# EAGLE design PSPS_AVNC_SRD_power-2020-10-14 (EAGLE 9.6.2)
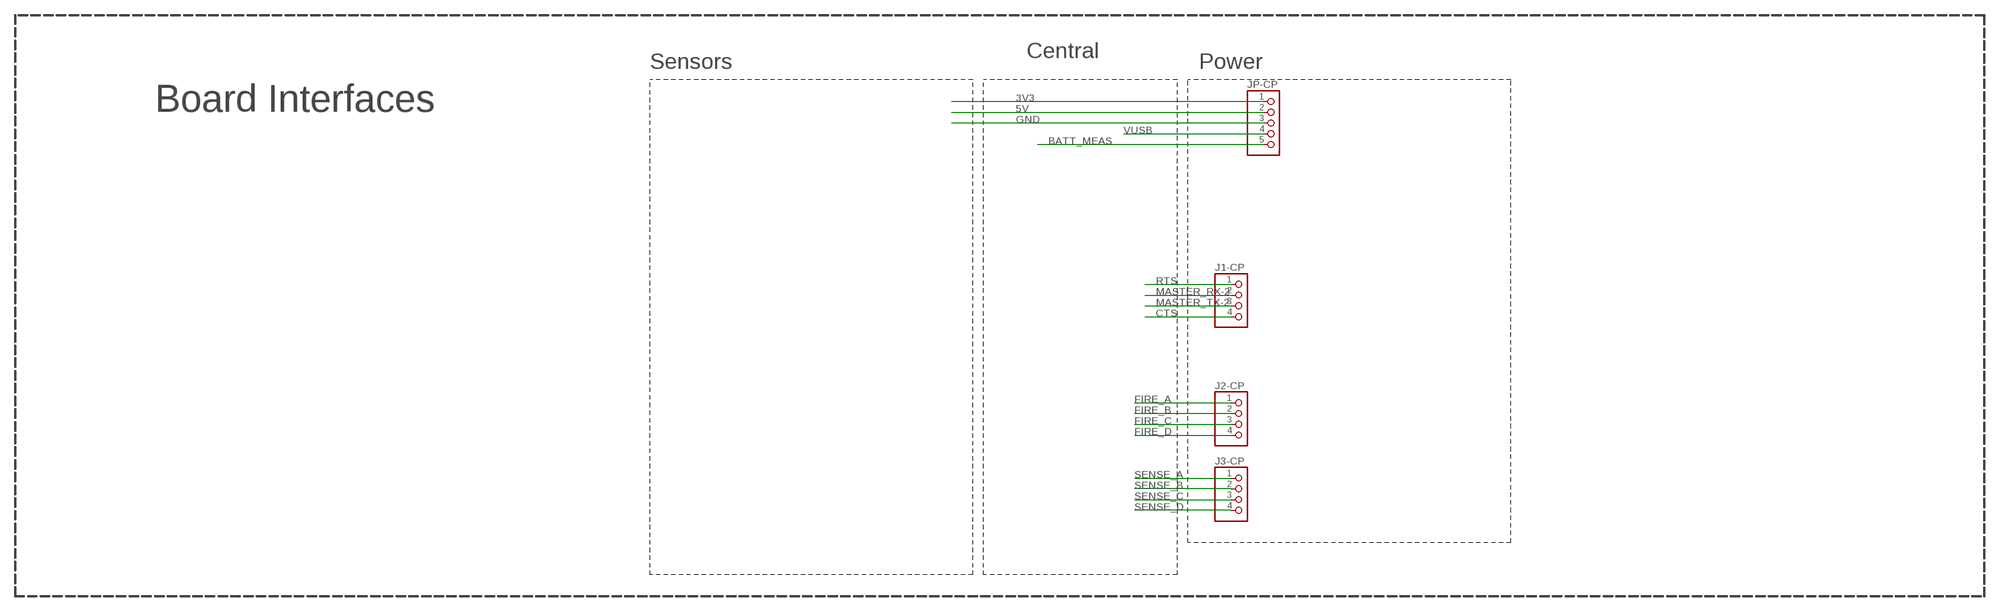
[diagram p0: schematic, sheet 1, part 1 of 3]
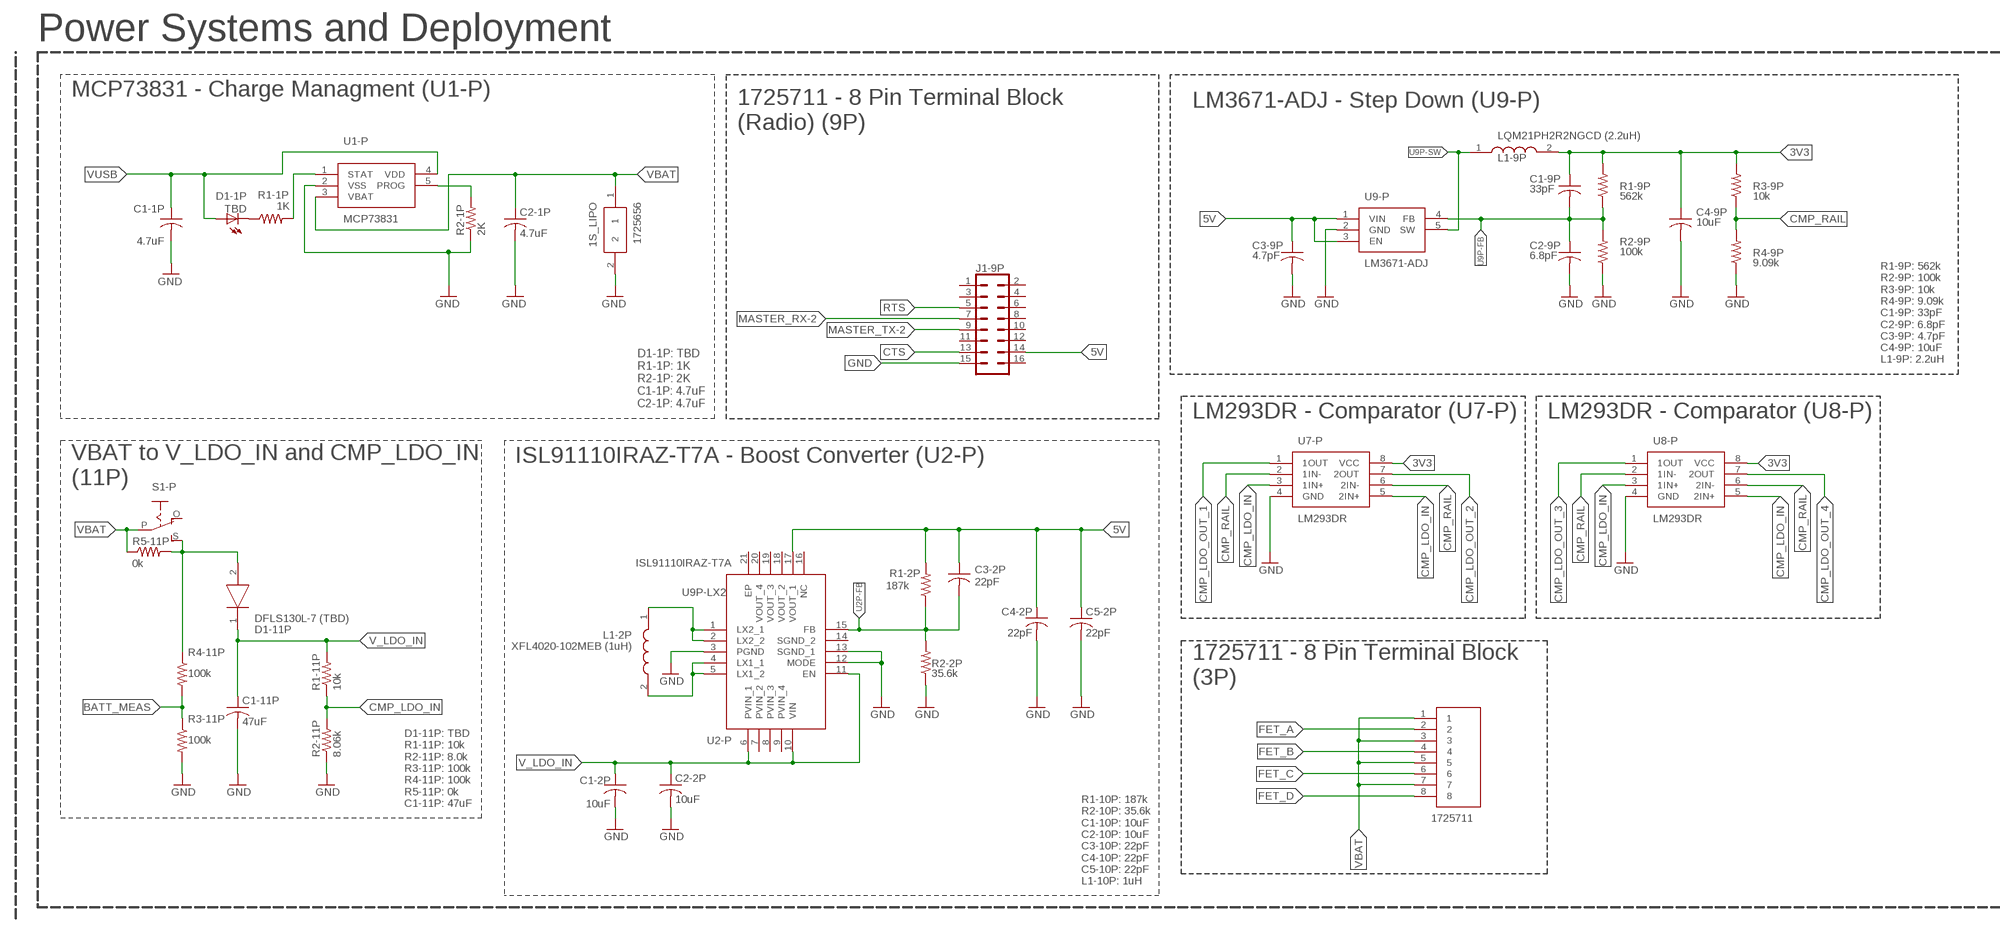
[diagram p1: schematic, sheet 1, part 2 of 3]
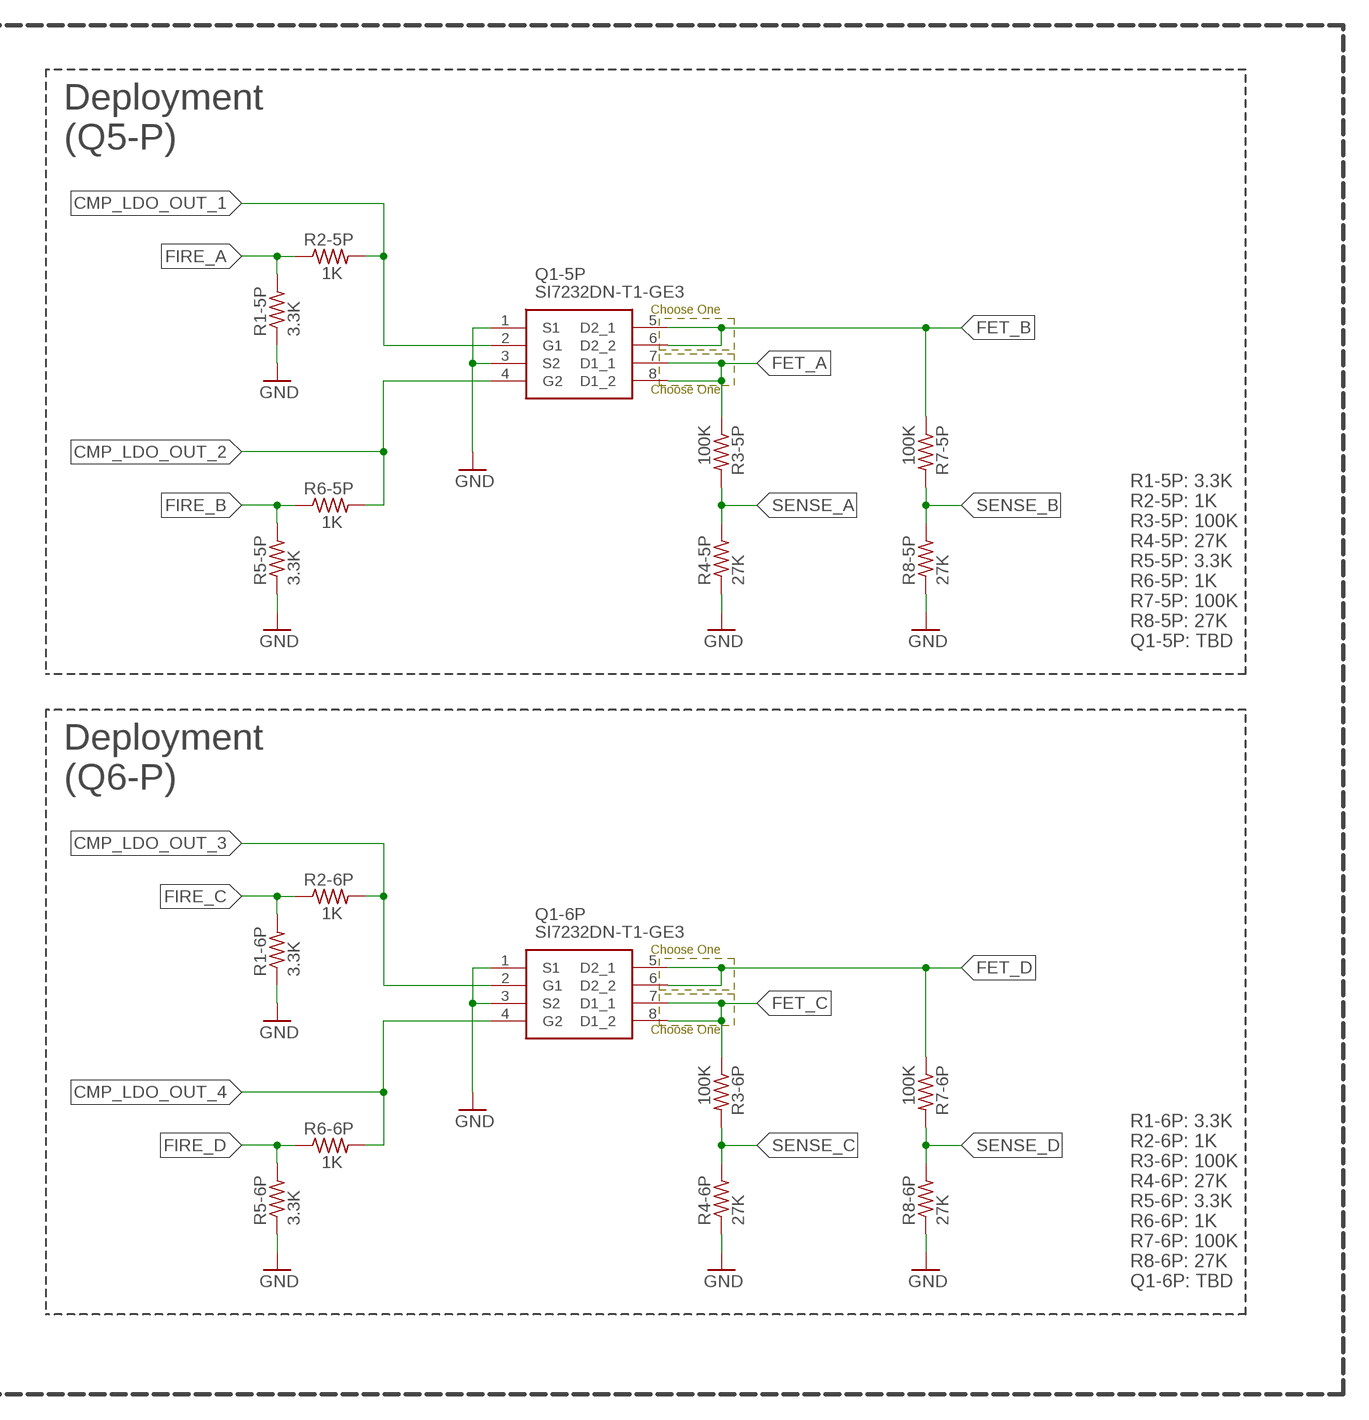
[diagram p2: schematic, sheet 1, part 3 of 3]

## Parts
1S_LIPO  1725656  [1725656]
C1-1P  4.7uF  C-USC0805  [C0805]
C1-2P  10uF  C-USC0805  [C0805]
C1-9P  33pF  C-USC0805  [C0805]
C1-11P  47uF  C-USC0805  [C0805]
C2-1P  4.7uF  C-USC0805  [C0805]
C2-2P  10uF  C-USC0805  [C0805]
C2-9P  6.8pF  C-USC0805  [C0805]
C3-2P  22pF  C-USC0805  [C0805]
C3-9P  4.7pF  C-USC0805  [C0805]
C4-2P  22pF  C-USC0805  [C0805]
C4-9P  10uF  C-USC0805  [C0805]
C5-2P  22pF  C-USC0805  [C0805]
D1-1P  TBD  LEDCHIPLED_0805  [CHIPLED_0805]
D1-11P  DFLS130L-7 (TBD)  DFLS130L-7  [POWERDI_123]
J1-9P  CONN_08X2  [2X8]
J1-CP  PINHD-1X4  [1X04]
J2-CP  PINHD-1X4  [1X04]
J2-P  1725711  [1725711]
J3-CP  PINHD-1X4  [1X04]
JP-CP  PINHD-1X5  [1X05]
L1-2P  XFL4020-102MEB (1uH)  XFL4020-102MEB  [XFL4020]
L1-9P  LQM21PH2R2NGCD (2.2uH)  LQM21PH2R2NGCD  [INDC2012X100N]
Q1-5P  SI7232DN-T1-GE3  [POWERPAK-1212-8]
Q1-6P  SI7232DN-T1-GE3  [POWERPAK-1212-8]
R1-1P  1K  R-US_R0805  [R0805]
R1-2P  187k  R-US_R0805  [R0805]
R1-5P  3.3K  R-US_M0805  [M0805]
R1-6P  3.3K  R-US_M0805  [M0805]
R1-9P  562k  R-US_R0805  [R0805]
R1-11P  10k  R-US_R0805  [R0805]
R2-1P  2K  R-US_R0805  [R0805]
R2-2P  35.6k  R-US_R0805  [R0805]
R2-5P  1K  R-US_M0805  [M0805]
R2-6P  1K  R-US_M0805  [M0805]
R2-9P  100k  R-US_R0805  [R0805]
R2-11P  8.06k  R-US_R0805  [R0805]
R3-5P  100K  R-US_M0805  [M0805]
R3-6P  100K  R-US_M0805  [M0805]
R3-9P  10k  R-US_R0805  [R0805]
R3-11P  100k  R-US_R0805  [R0805]
R4-5P  27K  R-US_M0805  [M0805]
R4-6P  27K  R-US_M0805  [M0805]
R4-9P  9.09k  R-US_R0805  [R0805]
R4-11P  100k  R-US_R0805  [R0805]
R5-5P  3.3K  R-US_M0805  [M0805]
R5-6P  3.3K  R-US_M0805  [M0805]
R5-11P  0k  R-US_R0805  [R0805]
R6-5P  1K  R-US_M0805  [M0805]
R6-6P  1K  R-US_M0805  [M0805]
R7-5P  100K  R-US_M0805  [M0805]
R7-6P  100K  R-US_M0805  [M0805]
R8-5P  27K  R-US_M0805  [M0805]
R8-6P  27K  R-US_M0805  [M0805]
S1-P  EG1218S  [EG1218]
U1-P  MCP73831  MCP73831T-2ACI_OT  [SOT95P270X145-5N]
U2-P  ISL91110IRAZ-T7A  [QFN50P400X400X100-21N]
U7-P  LM293DR  [SOIC127P600X175-8N]
U8-P  LM293DR  [SOIC127P600X175-8N]
U9-P  LM3671-ADJ  LM3671MFX-ADJ_NOPB  [SOT95P280X145-5N]

## Nets
3V3: C1-9P.1 C4-9P.1 JP-CP.1 L1-9P.2 R1-9P.2 R3-9P.2 U7-P.8(VCC) U8-P.8(VCC)
5V: C3-2P.1 C3-9P.1 C4-2P.1 C5-2P.1 J1-9P.14 JP-CP.2 R1-2P.2 U2-P.17(VOUT_1) U9-P.1(VIN) U9-P.3(EN)
BATT_MEAS: JP-CP.5 R3-11P.1 R4-11P.2
CMP_LDO_IN: R1-11P.1 R2-11P.2 U7-P.3(1IN+) U7-P.5(2IN+) U8-P.3(1IN+) U8-P.5(2IN+)
CMP_LDO_OUT_1: Q1-5P.2(G1) R2-5P.2 U7-P.1(1OUT)
CMP_LDO_OUT_2: Q1-5P.4(G2) R6-5P.2 U7-P.7(2OUT)
CMP_LDO_OUT_3: Q1-6P.2(G1) R2-6P.2 U8-P.1(1OUT)
CMP_LDO_OUT_4: Q1-6P.4(G2) R6-6P.2 U8-P.7(2OUT)
CMP_RAIL: R3-9P.1 R4-9P.2 U7-P.2(1IN-) U7-P.6(2IN-) U8-P.2(1IN-) U8-P.6(2IN-)
CTS: J1-9P.13 J1-CP.4
D1-1P_R1-1P: D1-1P.C R1-1P.1
FET_A: J2-P.2 Q1-5P.7(D1_1) Q1-5P.8(D1_2) R3-5P.1
FET_B: J2-P.4 Q1-5P.5(D2_1) Q1-5P.6(D2_2) R7-5P.1
FET_C: J2-P.6 Q1-6P.7(D1_1) Q1-6P.8(D1_2) R3-6P.1
FET_D: J2-P.8 Q1-6P.5(D2_1) Q1-6P.6(D2_2) R7-6P.1
FIRE_A: J2-CP.1 R1-5P.2 R2-5P.1
FIRE_B: J2-CP.2 R5-5P.2 R6-5P.1
FIRE_C: J2-CP.3 R1-6P.2 R2-6P.1
FIRE_D: J2-CP.4 R5-6P.2 R6-6P.1
GND: 1S_LIPO.2 C1-1P.2 C1-2P.2 C1-11P.2 C2-1P.2 C2-2P.2 C2-9P.2 C3-9P.2 C4-2P.2 C4-9P.2 C5-2P.2 J1-9P.15 JP-CP.3 Q1-5P.1(S1) Q1-5P.3(S2) Q1-6P.1(S1) Q1-6P.3(S2) R1-5P.1 R1-6P.1 R2-1P.1 R2-2P.1 R2-9P.1 R2-11P.1 R3-11P.2 R4-5P.1 R4-6P.1 R4-9P.1 R5-5P.1 R5-6P.1 R8-5P.1 R8-6P.1 U1-P.2(VSS) U2-P.3(PGND) U2-P.12(MODE) U2-P.13(SGND_1) U7-P.4(GND) U8-P.4(GND) U9-P.2(GND)
MASTER_RX-2: J1-9P.7 J1-CP.2
MASTER_TX-2: J1-9P.9 J1-CP.3
RTS: J1-9P.5 J1-CP.1
SENSE_A: J3-CP.1 R3-5P.2 R4-5P.2
SENSE_B: J3-CP.2 R7-5P.2 R8-5P.2
SENSE_C: J3-CP.3 R3-6P.2 R4-6P.2
SENSE_D: J3-CP.4 R7-6P.2 R8-6P.2
U1P-PROG: R2-1P.2 U1-P.5(PROG)
U1P-STAT: R1-1P.2 U1-P.1(STAT)
U2P-FB: C3-2P.2 R1-2P.1 R2-2P.2 U2-P.15(FB)
U9P-FB: C1-9P.2 C2-9P.1 R1-9P.1 R2-9P.2 U9-P.4(FB)
U9P-LX1: L1-2P.2 U2-P.4(LX1_1) U2-P.5(LX1_2)
U9P-LX2: L1-2P.1 U2-P.1(LX2_1) U2-P.2(LX2_2)
U9P-SW: L1-9P.1 U9-P.5(SW)
V_LDO_IN: C1-2P.1 C1-11P.1 C2-2P.1 D1-11P.1(K) R1-11P.2 U2-P.6(PVIN_1) U2-P.10(VIN) U2-P.11(EN)
VBAT: 1S_LIPO.1 C2-1P.1 J2-P.1 J2-P.3 J2-P.5 J2-P.7 R5-11P.1 S1-P.P U1-P.3(VBAT)
VBAT_AFTER_SWITCH: D1-11P.2(A) R4-11P.1 R5-11P.2 S1-P.S
VUSB: C1-1P.1 D1-1P.A JP-CP.4 U1-P.4(VDD)
Unconnected: J1-9P.1 J1-9P.2 J1-9P.3 J1-9P.4 J1-9P.6 J1-9P.8 J1-9P.10 J1-9P.11 J1-9P.12 J1-9P.16 S1-P.O U2-P.7(PVIN_2) U2-P.8(PVIN_3) U2-P.9(PVIN_4) U2-P.14(SGND_2) U2-P.16(NC) U2-P.18(VOUT_2) U2-P.19(VOUT_3) U2-P.20(VOUT_4) U2-P.21(EP)

## Notes on the sheet
- Power Systems and Deployment
- MCP73831 - Charge Managment (U1-P)
- LM3671-ADJ - Step Down (U9-P)
- 1725711 - 8 Pin Terminal Block 
  (Radio) (9P)
- Deployment
  (Q5-P)
- Choose One
- Choose One
- R1-9P: 562k
  R2-9P: 100k
  R3-9P: 10k
  R4-9P: 9.09k
  C1-9P: 33pF
  C2-9P: 6.8pF
  C3-9P: 4.7pF
  C4-9P: 10uF
  L1-9P: 2.2uH
- D1-1P: TBD
  R1-1P: 1K
  R2-1P: 2K
  C1-1P: 4.7uF
  C2-1P: 4.7uF
- LM293DR - Comparator (U7-P) | LM293DR - Comparator (U8-P)
- R1-5P: 3.3K
  R2-5P: 1K
  R3-5P: 100K
  R4-5P: 27K
  R5-5P: 3.3K
  R6-5P: 1K
  R7-5P: 100K
  R8-5P: 27K
  Q1-5P: TBD
- ISL91110IRAZ-T7A - Boost Converter (U2-P)
- VBAT to V_LDO_IN and CMP_LDO_IN
  (11P)
- Deployment
  (Q6-P)
- Choose One
- Choose One
- 1725711 - 8 Pin Terminal Block
  (3P)
- D1-11P: TBD
  R1-11P: 10k
  R2-11P: 8.0k
  R3-11P: 100k
  R4-11P: 100k
  R5-11P: 0k
  C1-11P: 47uF
- R1-6P: 3.3K
  R2-6P: 1K
  R3-6P: 100K
  R4-6P: 27K
  R5-6P: 3.3K
  R6-6P: 1K
  R7-6P: 100K
  R8-6P: 27K
  Q1-6P: TBD
- R1-10P: 187k
  R2-10P: 35.6k
  C1-10P: 10uF
  C2-10P: 10uF
  C3-10P: 22pF
  C4-10P: 22pF
  C5-10P: 22pF
  L1-10P: 1uH
- Central
- Sensors | Power
- Board Interfaces

## Library data of the parts
1S_LIPO = SamacSys_Parts:1725656: 2 way PCB vertical mount terminal,2.54mm 2 way PCB vertical mount terminal,2.54mm Source: Datasheet <https://componentsearchengine.com/Datasheets/1/1725656.pdf>; DESCRIPTION: 2 way PCB vertical mount terminal,2.54mm 2 way PCB vertical mount terminal,2.54mm; HEIGHT: 8mm; MANUFACTURER_NAME: Phoenix Contact; MANUFACTURER_PART_NUMBER: 1725656; MOUSER_PART_NUMBER: 651-1725656; MOUSER_PRICE-STOCK: https://www.mouser.com/Search/Refine.aspx?Keyword=651-1725656
C1-1P C1-2P C1-9P C1-11P C2-1P C2-9P C3-2P C3-9P C4-9P = resistor:C-US: CAPACITOR, American symbol
C2-2P C5-2P = BeagleBone_Black_Wireless:C-US: CAPACITOR, American symbol
C4-2P = resistor:C-US: CAPACITOR, American symbol; SPICEPREFIX: C
D1-1P = adafruit:LED: LED OSRAM: - CHIPLED LG R971, LG N971, LY N971, LG Q971, LY Q971, LO R971, LY R971 LH N974, LH R974 LS Q976, LO Q976, LY Q976 LO Q996 - Hyper CHIPLED LW Q18S LB Q993, LB Q99A, LB R99A - SideLED LS A670, LO A670, LY A670, LG A670, LP A670 LB A673, LV A673, LT A673, LW A673 LH A674 LY A675 LS A676, LA A676, LO A676, LY A676, LW A676 LS A679, LY A679, LG A679 - Hyper Micro SIDELED® LS Y876, LA Y876, LO Y876, LY Y876 LT Y87S - SmartLED LW L88C, LW L88S LB L89C, LB L89S, LG L890 LS L89K, LO L89K, LY L89K LS L896, LA L896, LO L896, LY L896 - TOPLED LS T670, LO T670, LY T670, LG T670, LP T670 LSG T670, LSP T670, LSY T670, LOP T670, LYG T670 LG T671, LOG T671, LSG T671 LB T673, LV T673, LT T673, LW T673 LH T674 LS T676, LA T676, LO T676, LY T676, LB T676, LH T676, LSB T676, LW T676 LB T67C, LV T67C, LT T67C, LS T67K, LO T67K, LY T67K, LW E67C LS E67B, LA E67B, LO E67B, LY E67B, LB E67C, LV E67C, LT E67C LW T67C LS T679, LY T679, LG T679 LS T770, LO T770, LY T770, LG T770, LP T770 LB T773, LV T773, LT T773, LW T773 LH T774 LS E675, LA E675, LY E675, LS T675 LS T776, LA T776, LO T776, LY T776, LB T776 LHGB T686 LT T68C, LB T68C - Hyper Mini TOPLED® LB M676 - Mini TOPLED Santana® LG M470 LS M47K, LO M47K, LY M47K Source: http://www.osram.convergy.de/
D1-11P = SamacSys_Parts:DFLS130L-7: 1.0A SURFACE MOUNT SCHOTTKY BARRIER RECTIFIER Source: Datasheet <https://componentsearchengine.com/Datasheets/1/DFLS130L-7.pdf>; DESCRIPTION: 1.0A SURFACE MOUNT SCHOTTKY BARRIER RECTIFIER; HEIGHT: mm; MANUFACTURER_NAME: Diodes Inc.; MANUFACTURER_PART_NUMBER: DFLS130L-7; MOUSER_PART_NUMBER: 621-DFLS130L; MOUSER_PRICE-STOCK: https://www.mouser.com/Search/Refine.aspx?Keyword=621-DFLS130L
J1-9P = SparkFun-Connectors:CONN_08X2: Multi connection point. Often used as Generic Header-pin footprint for 0.1 inch spaced/style header connections You can populate with any combo of single row headers, but if you'd like an exact match, check this: Header - 2x8 (Male, 0.1") <https://www.sparkfun.com/products/13156> (PRT-13156) On any of the 0.1 inch spaced packages, you can populate with these: Break Away Headers - Straight <https://www.sparkfun.com/products/116> (PRT-00116) Break Away Male Headers - Right Angle <https://www.sparkfun.com/products/553> (PRT-00553) Female Headers <https://www.sparkfun.com/products/115> (PRT-00115) Break Away Headers - Machine Pin <https://www.sparkfun.com/products/117> (PRT-00117) Break Away Female Headers - Swiss Machine Pin <https://www.sparkfun.com/products/743> (PRT-00743)
J1-CP J2-CP J3-CP = pinhead:PINHD-1X4: PIN HEADER
J2-P = SamacSys_Parts:1725711: 8 way PCB vertical mount terminal,2.54mm 8 way PCB vertical mount terminal,2.54mm Source: Datasheet <https://componentsearchengine.com/Datasheets/1/1725711.pdf>; DESCRIPTION: 8 way PCB vertical mount terminal,2.54mm 8 way PCB vertical mount terminal,2.54mm; HEIGHT: mm; MANUFACTURER_NAME: Phoenix Contact; MANUFACTURER_PART_NUMBER: 1725711; MOUSER_PART_NUMBER: 651-1725711; MOUSER_PRICE-STOCK: https://www.mouser.com/Search/Refine.aspx?Keyword=651-1725711
JP-CP = pinhead:PINHD-1X5: PIN HEADER
L1-2P = SamacSys_Parts:XFL4020-102MEB: Fixed Inductors XFL4020 AEC-Q200 1 uH 20% 11 A Compos Source: Datasheet <https://componentsearchengine.com/Datasheets/1/XFL4020-102MEB.pdf>; DESCRIPTION: Fixed Inductors XFL4020 AEC-Q200 1 uH 20% 11 A Compos; HEIGHT: mm; MANUFACTURER_NAME: COILCRAFT; MANUFACTURER_PART_NUMBER: XFL4020-102MEB; MOUSER_PART_NUMBER: 994-XFL4020-102MEB; MOUSER_PRICE-STOCK: https://www.mouser.com/Search/Refine.aspx?Keyword=994-XFL4020-102MEB
L1-9P = SamacSys_Parts:LQM21PH2R2NGCD: LQM21PH_GC Series Inductor 2.2uH +/-30% 0805 (2012) Source: Datasheet <https://componentsearchengine.com/Datasheets/1/LQM21PH2R2NGCD.pdf>; DESCRIPTION: LQM21PH_GC Series Inductor 2.2uH +/-30% 0805 (2012); HEIGHT: 1mm; MANUFACTURER_NAME: Murata Electronics; MANUFACTURER_PART_NUMBER: LQM21PH2R2NGCD; MOUSER_PART_NUMBER: 81-LQM21PH2R2NGCD; MOUSER_PRICE-STOCK: https://www.mouser.com/Search/Refine.aspx?Keyword=81-LQM21PH2R2NGCD
Q1-5P Q1-6P = SamacSys_Parts:SI7232DN-T1-GE3: Trans MOSFET N-CH 20V 10An Vishay SI7232DN-T1-GE3 Dual N-channel MOSFET Transistor, 24 A, 20 V, 8-Pin PowerPAK 1212 Source: Datasheet <http://www.mouser.com/ds/2/427/si7232dn-279732.pdf>; ARROW_PART_NUMBER: SI7232DN-T1-GE3; ARROW_PRICE-STOCK: https://www.arrow.com/en/products/si7232dn-t1-ge3/vishay; DESCRIPTION: Trans MOSFET N-CH 20V 10An Vishay SI7232DN-T1-GE3 Dual N-channel MOSFET Transistor, 24 A, 20 V, 8-Pin PowerPAK 1212; HEIGHT: mm; MANUFACTURER_NAME: Vishay; MANUFACTURER_PART_NUMBER: SI7232DN-T1-GE3; MOUSER_PART_NUMBER: 781-SI7232DN-GE3; MOUSER_PRICE-STOCK: https://www.mouser.co.uk/ProductDetail/Vishay-Semiconductors/SI7232DN-T1-GE3?qs=%252BPu8jn5UVnH5FJ8Jo4EbFw%3D%3D
R1-1P R1-2P R1-9P R1-11P R2-1P R2-2P R2-9P R2-11P R3-9P R4-9P = resistor:R-US_: RESISTOR, American symbol
R1-5P R1-6P R2-5P R2-6P R3-5P R3-6P R4-5P R4-6P R5-5P R5-6P R6-5P R6-6P R7-5P R7-6P R8-5P R8-6P = rcl:R-US_: RESISTOR, American symbol; SPICEPREFIX: R
R3-11P R4-11P R5-11P = PulseOximeterECG_AU:R-US_: RESISTOR, American symbol; SPICEPREFIX: R
S1-P = adafruit:EG1218: SLIDING SWITCH 0.1" spacing through hole, vertical SPDT slide switch http://www.ladyada.net/library/pcb/eaglelibrary.html
U1-P = SamacSys_Parts:MCP73831T-2ACI_OT: Li-Ion Charge Controller 4.2V SOT23-5 Source: Datasheet <http://ww1.microchip.com/downloads/en/DeviceDoc/20001984g.pdf>; DESCRIPTION: Li-Ion Charge Controller 4.2V SOT23-5; HEIGHT: 1.45mm; MANUFACTURER_NAME: Microchip; MANUFACTURER_PART_NUMBER: MCP73831T-2ACI/OT; MOUSER_PART_NUMBER: 579-MCP73831T-2ACIOT; MOUSER_PRICE-STOCK: https://www.mouser.co.uk/ProductDetail/Microchip-Technology/MCP73831T-2ACI-OT?qs=yUQqVecv4qvbBQBGbHx0Mw%3D%3D
U2-P = SamacSys_Parts:ISL91110IRAZ-T7A: Integrated FET Regulators High Current Buck Boost Switching Regulator Delivering 2A of Continuous Output Current Source: Datasheet <https://www.renesas.com/en-us/www/doc/datasheet/isl91110ir.pdf>; DESCRIPTION: Integrated FET Regulators High Current Buck Boost Switching Regulator Delivering 2A of Continuous Output Current; HEIGHT: 1mm; MANUFACTURER_NAME: Renesas Electronics; MANUFACTURER_PART_NUMBER: ISL91110IRAZ-T7A
U7-P U8-P = SamacSys_Parts:LM293DR: Dual differential comparator, industrial grade Source: Datasheet <http://www.ti.com/lit/gpn/lm293>; DESCRIPTION: Dual differential comparator, industrial grade; HEIGHT: 1.75mm; MANUFACTURER_NAME: Texas Instruments; MANUFACTURER_PART_NUMBER: LM293DR; MOUSER_PART_NUMBER: 595-LM293DR; MOUSER_PRICE-STOCK: https://www.mouser.com/Search/Refine.aspx?Keyword=595-LM293DR
U9-P = SamacSys_Parts:LM3671MFX-ADJ_NOPB: 2MHz, 600mA Step-Down DC-DC Converter Source: Datasheet <http://www.ti.com/lit/gpn/lm3671>; DESCRIPTION: 2MHz, 600mA Step-Down DC-DC Converter; HEIGHT: 1.45mm; MANUFACTURER_NAME: Texas Instruments; MANUFACTURER_PART_NUMBER: LM3671MFX-ADJ/NOPB; MOUSER_PART_NUMBER: 926-LM3671MFXADJNOPB; MOUSER_PRICE-STOCK: https://www.mouser.com/Search/Refine.aspx?Keyword=926-LM3671MFXADJNOPB

## Board
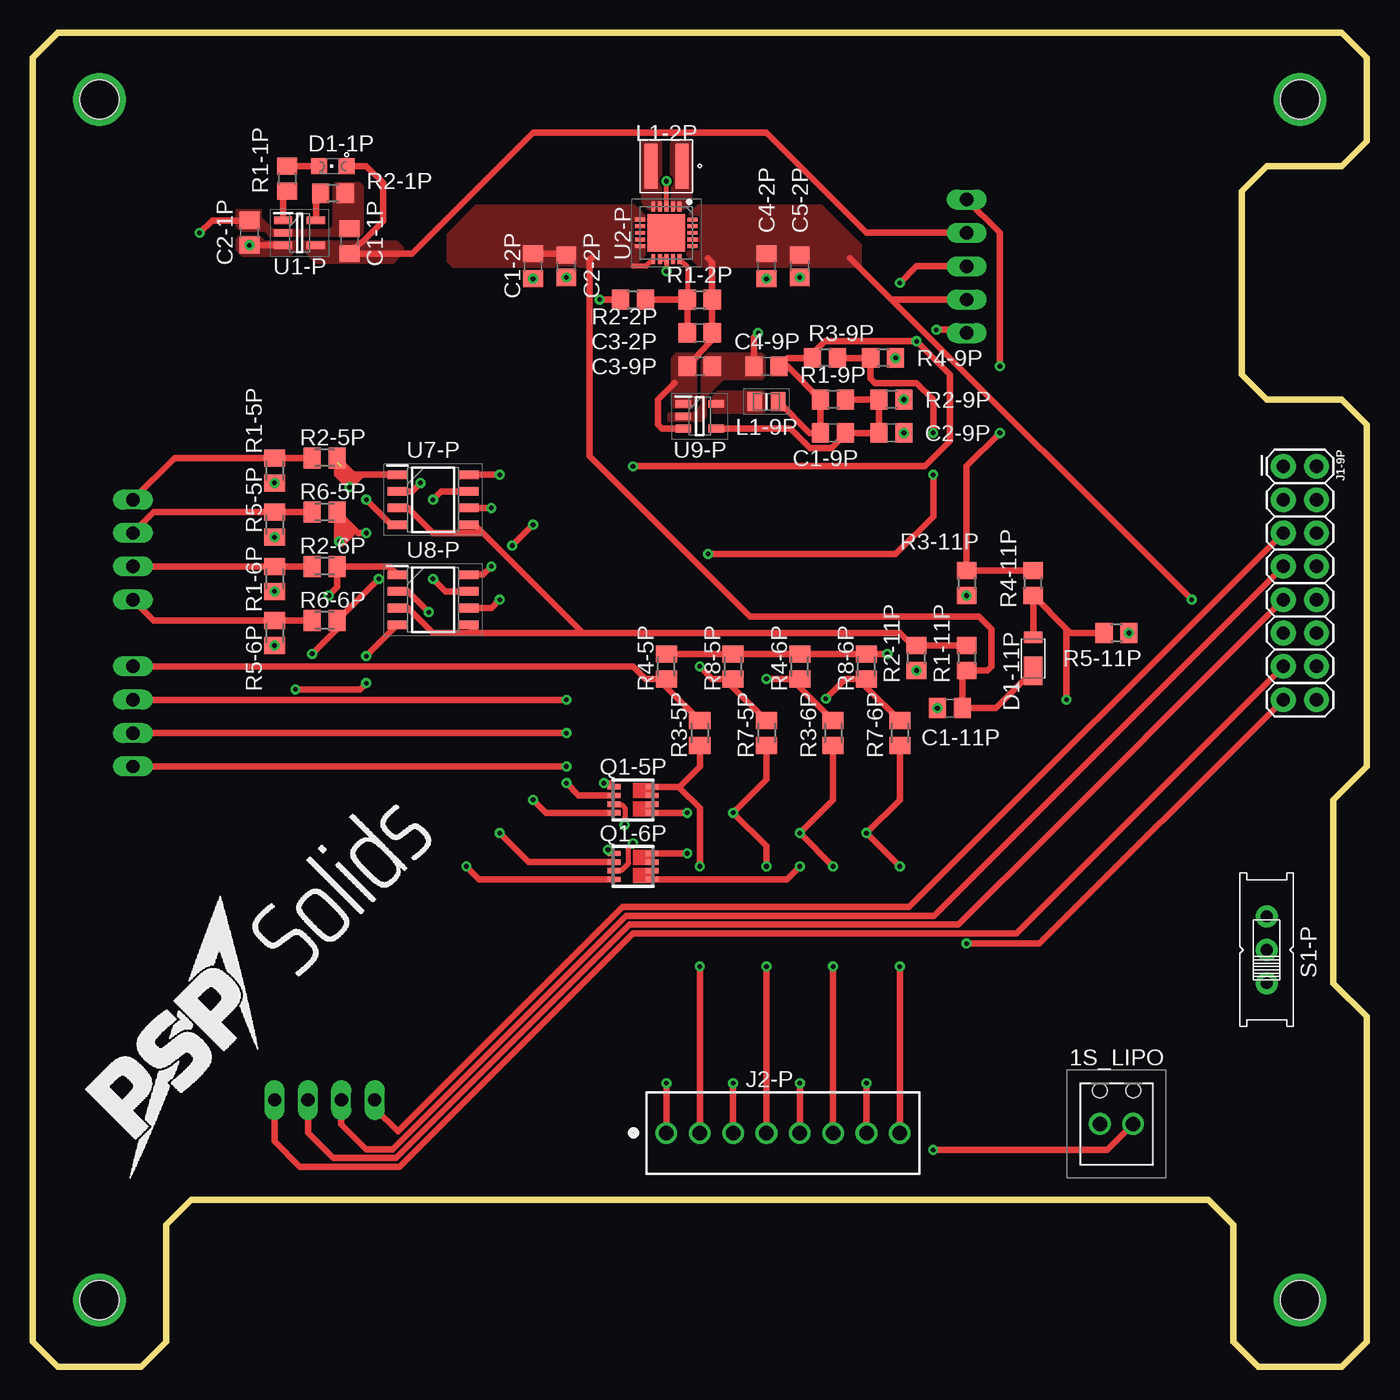
[diagram p3: board, top side]
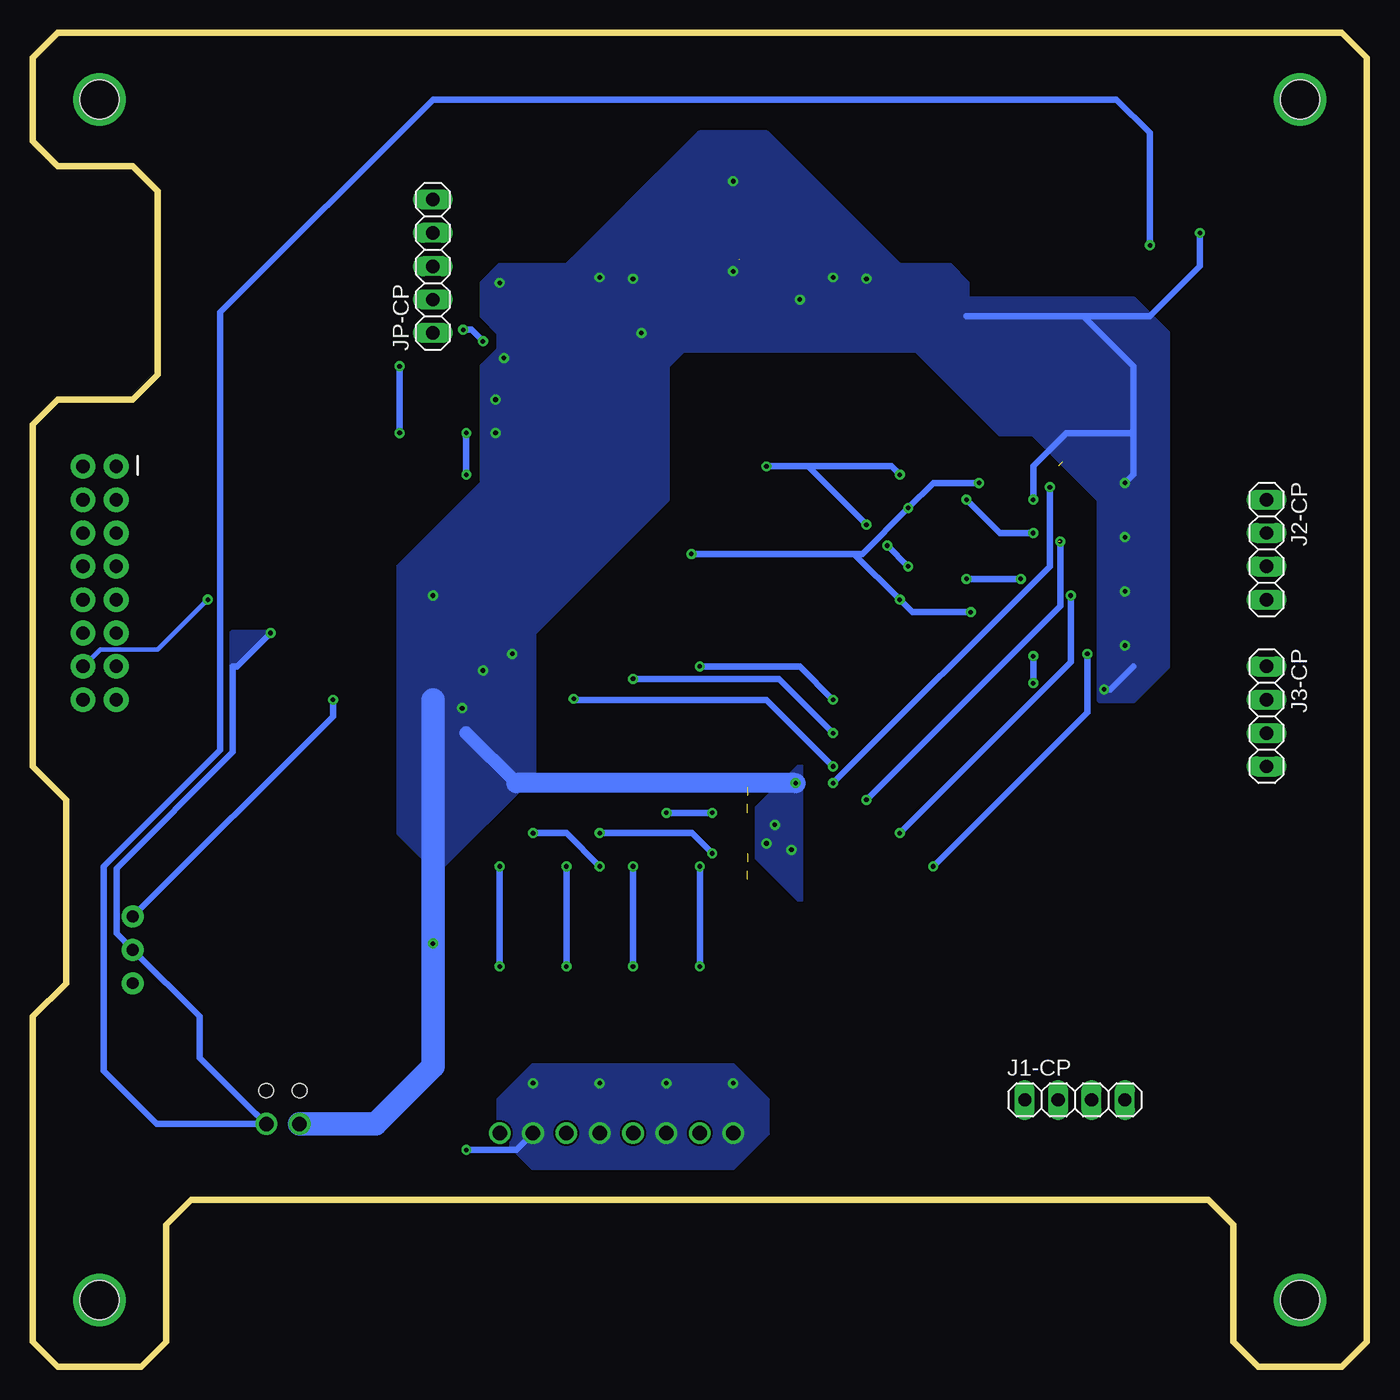
[diagram p4: board, bottom side, seen from below]

Size 101.6 x 101.6 mm. Coordinates in mm from the lower left corner, seen from the top.
Outline: 1.91,0 8.26,0 10.16,1.91 10.16,10.79 12.06,12.7 89.53,12.7 91.44,10.79 91.44,1.91 93.34,0 99.69,0 101.6,1.91 101.6,26.67 99.06,29.21 99.06,43.18 101.6,45.72 101.6,71.75 99.69,73.66 93.98,73.66 92.08,75.56 92.08,89.53 93.98,91.44 99.69,91.44 101.6,93.34 101.6,99.69 99.69,101.6 1.91,101.6 0,99.69 0,1.91 1.91,0
Copper layers (1*16): Top 0.035mm / dielectric 1.5mm / Bottom 0.035mm
Design rules "default *": minimum track width 6mil, minimum drill 0.35mm, track to track 6mil, track to pad 6mil, pad to pad 6mil, via to via 6mil, smd to smd 6mil, copper to edge 40mil, drill to drill 6mil, minimum pad ring 10mil, minimum via ring 8mil, stop-mask expansion 4mil, vias tented up to drill 0mil, thermal gap 10mil
Holes 3 mm at 5.08,96.52 96.52,96.52 96.52,5.08 5.08,5.08

### Footprints (pad centres in the part's own frame; a part is rotated, then mirrored left to right if it is on the bottom)
1725656 = drill 1.1 pad 1.65: 1 -1.27,3.1; 2 1.27,3.1 | hole 1.1: -1.27,0.56; 1.27,0.56
C0805 = smd 1.3 x 1.5: 1 -0.95,0; 2 0.95,0
C0805' = smd 1.3 x 1.5: 1 -0.85,0; 2 0.85,0
CHIPLED_0805 = smd 1.2 x 1.2: A 0,-1.05; C 0,1.05
POWERDI_123 = smd 2.2 x 1.4: 1 -1.6,0 | smd 0.9 x 1.4: 2 0.95,0
2X8 = drill 1.016 pad 1.88: 1 0,0; 2 0,2.54; 3 2.54,0; 4 2.54,2.54; 5 5.08,0; 6 5.08,2.54; 7 7.62,0; 8 7.62,2.54; 9 10.16,0; 10 10.16,2.54; 11 12.7,0; 12 12.7,2.54; 13 15.24,0; 14 15.24,2.54; 15 17.78,0; 16 17.78,2.54
1X04 = drill 1.016 long: 1 -3.81,0; 2 -1.27,0; 3 1.27,0; 4 3.81,0
1725711 = drill 1.1 pad 1.65: 1 -8.89,0; 2 -6.35,0; 3 -3.81,0; 4 -1.27,0; 5 1.27,0; 6 3.81,0; 7 6.35,0; 8 8.89,0
1X05 = drill 1.016 long: 1 -5.08,0; 2 -2.54,0; 3 0,0; 4 2.54,0; 5 5.08,0
XFL4020 = smd 0.98 x 3.4: 1 -1.185,0; 2 1.185,0
INDC2012X100N = smd 1.1 x 1.45: 1 -0.9,0; 2 0.9,0
POWERPAK-1212-8 = smd 0.99 x 0.405: 1 -1.435,0.99; 2 -1.435,0.33; 3 -1.435,-0.33; 4 -1.435,-0.99; 5 1.435,-0.99; 6 1.435,-0.33; 7 1.435,0.33; 8 1.435,0.99
R0805 = smd 1.3 x 1.5: 1 -0.95,0; 2 0.95,0
M0805 = smd 1.3 x 1.6: 1 -0.95,0; 2 0.95,0
EG1218 = drill 0.9 pad 1.676: O -2.54,0; P 0,0; S 2.54,0
SOT95P270X145-5N = smd 1.4 x 0.6: 1 -1.25,0.95; 2 -1.25,0; 3 -1.25,-0.95; 4 1.25,-0.95; 5 1.25,0.95
QFN50P400X400X100-21N = smd 0.75 x 0.3: 1 -2,1; 2 -2,0.5; 3 -2,0; 4 -2,-0.5; 5 -2,-1; 11 2,-1; 12 2,-0.5; 13 2,0; 14 2,0.5; 15 2,1 | smd 0.3 x 0.75: 6 -1,-2; 7 -0.5,-2; 8 0,-2; 9 0.5,-2; 10 1,-2; 16 1,2; 17 0.5,2; 18 0,2; 19 -0.5,2; 20 -1,2 | smd 2.85 x 2.85: 21 0,0
SOIC127P600X175-8N = smd 1.525 x 0.65: 1 -2.712,1.905; 2 -2.712,0.635; 3 -2.712,-0.635; 4 -2.712,-1.905; 5 2.712,-1.905; 6 2.712,-0.635; 7 2.712,0.635; 8 2.712,1.905
SOT95P280X145-5N = smd 1.2 x 0.6: 1 -1.25,0.95; 2 -1.25,0; 3 -1.25,-0.95; 4 1.25,-0.95; 5 1.25,0.95

### Placement (x,y rotation side)
1S_LIPO  82.55,21.59 180 top
C1-1P  24.13,85.72 90 top
C1-2P  38.1,83.82 270 top
C1-9P  60.96,71.12 0 top
C1-11P  69.85,50.16 180 top
C2-1P  16.51,86.36 90 top
C2-2P  10uF  [C0805']  40.64,83.82 270 top
C2-9P  65.41,71.12 0 top
C3-2P  50.8,78.74 180 top
C3-9P  50.8,76.2 0 top
C4-2P  55.88,83.82 270 top
C4-9P  55.88,76.2 180 top
C5-2P  22pF  [C0805']  58.42,83.82 270 top
D1-1P  22.86,91.44 90 top
D1-11P  76.2,54.61 90 top
J1-9P  95.25,68.58 270 top
J1-CP  22.23,20.32 0 bottom
J2-CP  7.62,62.23 270 bottom
J2-P  57.15,17.78 0 top
J3-CP  7.62,49.53 270 bottom
JP-CP  71.12,83.82 90 bottom
L1-2P  48.26,91.44 180 top
L1-9P  55.88,73.5 0 top
Q1-5P  45.72,43.18 0 top
Q1-6P  45.72,38.1 0 top
R1-1P  19.37,90.49 270 top
R1-2P  50.8,81.28 0 top
R1-5P  18.41,68.26 90 top
R1-6P  18.41,60.01 90 top
R1-9P  60.96,73.66 180 top
R1-11P  71.12,53.98 270 top
R2-1P  22.86,89.38 180 top
R2-2P  45.72,81.28 0 top
R2-5P  22.23,69.22 0 top
R2-6P  22.23,60.96 0 top
R2-9P  65.41,73.66 180 top
R2-11P  67.31,53.98 90 top
R3-5P  50.8,48.26 90 top
R3-6P  60.96,48.26 90 top
R3-9P  60.33,76.83 180 top
R3-11P  71.12,59.69 270 top
R4-5P  48.26,53.34 270 top
R4-6P  58.42,53.34 270 top
R4-9P  64.77,76.83 180 top
R4-11P  76.2,59.69 90 top
R5-5P  18.41,64.14 90 top
R5-6P  18.41,55.88 90 top
R5-11P  82.55,55.88 180 top
R6-5P  22.23,65.09 0 top
R6-6P  22.23,56.83 0 top
R7-5P  55.88,48.26 90 top
R7-6P  66.04,48.26 90 top
R8-5P  53.34,53.34 270 top
R8-6P  63.5,53.34 270 top
S1-P  93.98,31.75 90 top
U1-P  20.32,86.36 0 top
U2-P  48.26,86.36 270 top
U7-P  30.48,66.04 0 top
U8-P  30.48,58.42 0 top
U9-P  50.8,72.39 0 top

### Tracks (layer width: path | path; a pad name or v marks a point on that pad's centre or on a via)
3V3  (via drill 0.35)
  Top 0.508: v68.82,78.98 70.88,78.98 JP-CP.1 | v38.1,64.14 v36.51,62.55 | v34.92,60.96 34.29,60.33 U8-P.8 | v35.56,67.94 U7-P.8 | L1-9P.2 59.16,71.12 C1-9P.1 R1-9P.2 57.47,76.2 C4-9P.1 57.47,76.83 R3-9P.2 59.38,77.16 60.33,78.11 v67.31,78.11 69.85,75.56 69.85,70.48 67.94,68.58 v45.72,68.58
  Bottom 0.508: v45.72,68.58 42.55,68.58 | v38.1,64.14 42.55,68.58 | v36.51,62.55 v34.92,60.96 | 42.55,68.58 36.2,68.58 v35.56,67.94 | v67.31,78.11 68.18,78.98 v68.82,78.98
5V  (via drill 0.35)
  Top 0.508: C4-2P.1 55.98,84.67 | 58.48,84.61 C5-2P.1 | 65.41,81.28 62.23,84.45 | JP-CP.2 65.41,81.28 | 51.44,84.45 51.75,84.14 R1-2P.2 C3-2P.1 51.75,78.17 50.69,77.12 50.69,77.04 C3-9P.1 | U9-P.3 47.94,71.44 47.62,71.75 47.62,73.66 48.9,74.93 | v88.27,58.42 65.41,81.28
  Bottom 0.254: J1-9P.14 97.74,53.34
  Bottom 0.356: 97.74,53.34 96.47,54.61 93.98,54.61 92.71,54.61 92.08,54.61 v88.27,58.42
  pour Top (no thermals): 55.88,83.82 50.8,83.82 49.91,84.71 49.91,87.63 50.67,88.39 60.07,88.39 62.87,85.6 62.99,85.47 62.99,83.82
  pour Top (no thermals): 48.64,73.28 48.9,73.03 50.16,73.03 50.55,73.41 50.55,76.96 50.29,77.22 49.02,77.22 48.64,76.83
BATT_MEAS  (via drill 0.35)
  Top 0.508: R4-11P.2 R3-11P.1 71.12,63.18 71.12,63.5 71.12,68.58 v73.66,71.12 | JP-CP.5 73.66,86.36 v73.66,76.2
  Bottom 0.508: v73.66,76.2 v73.66,71.12
CMP_LDO_IN
  Top 0.508: R1-11P.1 R2-11P.2 67,54.92 66.04,55.88 41.91,55.88 | 41.91,55.88 33.83,55.88 | 34.29,63.5 33.66,64.14 U7-P.5 | 34.29,63.5 41.91,55.88 | U8-P.3 28.57,57.78 30.48,55.88 33.83,55.88 | U7-P.3 28.57,65.41 30.48,63.5 34.29,63.5 | U8-P.5 33.83,55.88
CMP_LDO_OUT_1  (via drill 0.35)  (1 unrouted)
  Top 0.508: Q1-5P.2 41.58,43.51 v40.64,44.45 | U7-P.1 25.4,67.94 25.08,67.94 | 25.08,67.94 24.45,67.94 R2-5P.2 | R2-5P.2 23.18,68.89 | R2-5P.2 23.18,67.95 v24.13,66.99 25.08,67.94
  Top 0.813: 23.5,68.58 23.5,67.94 24.13,67.31 24.13,67.94
  Bottom 0.508: v24.13,66.99 24.13,60.96 v40.64,44.45
CMP_LDO_OUT_2  (via drill 0.35)  (1 unrouted)
  Top 0.508: v38.1,43.18 39.09,42.19 Q1-5P.4 | v23.34,62.87 23.18,63.03 R6-5P.2 24.76,63.5 v25.4,63.5 | U7-P.7 31.11,66.67 v30.48,66.04
  Top 0.813: 23.5,62.87 24.13,63.5 23.5,64.14 23.5,63.5
  Bottom 0.508: v23.34,62.87 23.34,57.94 v38.1,43.18 | v30.48,66.04 27.94,63.5 v25.4,63.5
CMP_LDO_OUT_3  (via drill 0.35)
  Top 0.508: v35.56,40.64 37.77,38.43 Q1-6P.2 | U8-P.1 27.13,60.96 R2-6P.2 23.18,59.37 v22.54,58.74
  Bottom 0.508: v22.54,58.74 22.54,53.66 v35.56,40.64
CMP_LDO_OUT_4  (via drill 0.35)
  Top 0.508: v33.02,38.1 34.01,37.11 Q1-6P.4 | v21.27,54.29 23.18,56.2 R6-6P.2 v26.35,60.01 | U8-P.7 31.43,59.05 v30.48,60.01
  Bottom 0.508: v21.27,54.29 21.27,49.85 v33.02,38.1 | v30.48,60.01 v26.35,60.01
CMP_RAIL  (via drill 0.35)
  Top 0.508: v34.92,65.41 U7-P.6 | U8-P.6 34.92,57.78 v35.56,58.42 | v29.53,67.31 28.89,66.67 U7-P.2 | v30.16,57.47 28.57,59.05 U8-P.2 | v51.44,61.91 65.72,61.91 68.58,64.77 v68.58,67.94 | R3-9P.1 R4-9P.2 63.82,75.25 64.14,74.93 67.31,74.93 68.58,73.66 v68.58,71.12
  Bottom 0.508: v51.44,61.91 39.05,61.91 | 39.05,61.91 38.42,61.91 v34.92,65.41 33.02,67.31 v29.53,67.31 | 39.05,61.91 v35.56,58.42 34.61,57.47 v30.16,57.47 | v68.58,71.12 v68.58,67.94
CTS
  Top 0.508: J1-9P.13 74.93,33.02 45.72,33.02 27.94,15.24 20.32,15.24 18.41,17.14 J1-CP.4
D1-1P_R1-1P
  Top 0.508: R1-1P.1 D1-1P.C
FET_A  (via drill 0.35)  (1 unrouted)
  Top 0.508: v50.8,30.48 J2-P.2 | Q1-5P.8 49.25,44.17 | 49.25,44.17 50.8,45.72 R3-5P.1 | 49.25,44.17 49.25,44.09 50.8,42.55 v50.8,38.1
  Bottom 0.508: v50.8,38.1 v50.8,30.48
FET_B  (via drill 0.35)  (1 unrouted)
  Top 0.508: v55.88,30.48 J2-P.4 | Q1-5P.5 v49.85,42.19 | R7-5P.1 55.88,44.73 v53.34,42.19 55.88,39.65 v55.88,38.1
  Bottom 0.508: v55.88,38.1 v55.88,30.48 | v49.85,42.19 v53.34,42.19
FET_C  (via drill 0.35)  (1 unrouted)
  Top 0.508: v60.96,30.48 J2-P.6 | Q1-6P.8 v49.85,39.09 | R3-6P.1 60.96,43.18 v58.42,40.64 v60.96,38.1
  Bottom 0.508: v60.96,38.1 v60.96,30.48 | v49.85,39.09 51.4,40.64 v58.42,40.64
FET_D  (via drill 0.35)  (1 unrouted)
  Top 0.508: v66.04,30.48 J2-P.8 | Q1-6P.5 57.43,37.11 v58.42,38.1 | v66.04,38.1 v63.5,40.64 66.04,43.18 R7-6P.1
  Bottom 0.508: v66.04,38.1 v66.04,30.48 | v58.42,38.1 60.96,40.64 v63.5,40.64
FIRE_A
  Top 0.508: J2-CP.1 10.79,69.21 R1-5P.2 R2-5P.1
FIRE_B
  Top 0.508: J2-CP.2 9.21,65.08 R5-5P.2 R6-5P.1
FIRE_C
  Top 0.508: J2-CP.3 R1-6P.2 R2-6P.1
FIRE_D
  Top 0.508: J2-CP.4 9.21,56.83 R5-6P.2 R6-6P.1
GND  (via drill 0.35)  (1 unrouted)
  Top 0.381: 47.79,84.36 U2-P.13 v48.26,83.44 | U2-P.3 v48.26,90.3 | Q1-6P.3 44.35,37.83 44.87,37.83 45.38,38.34 45.38,39.51 v45.72,39.85 | Q1-5P.3 44.35,42.79 44.87,42.79 45.12,42.53 45.12,41.84 45.09,41.81 v45.09,41.27
  Top 0.432: Q1-6P.1 44.01,39.37 v43.81,39.37 | Q1-5P.1 44.01,44.45 v43.5,44.45
  Top 0.508: C1-2P.2 38.2,82.97 | R2-2P.1 v43.18,81.28 | JP-CP.3 67.31,83.82 v66.04,82.55 | C2-1P.2 13.65,87.31 v12.7,86.36 | C4-9P.2 54.93,78.42 v55.24,78.74 | R4-5P.1 R8-5P.1 R4-6P.1 R8-6P.1 v65.09,54.29 | U7-P.4 27.3,64.14 v25.4,66.04 | U8-P.4 25.4,54.15 v25.4,54.12 | v25.4,52.07 24.91,51.59 v20,51.59 | J1-9P.15 76.69,32.23 v71.12,32.23
  Bottom 0.508: v12.7,86.36 12.7,83.82 16.51,80.01 21.59,80.01 | R1-5P.1 17.78,67.95 17.78,71.12 | 17.78,71.12 17.78,76.2 21.59,80.01 | 21.59,80.01 30.48,80.01 | v25.4,66.04 25.4,68.58 22.86,71.12 17.78,71.12 | v25.4,54.12 v25.4,52.07 | v20,51.59 19.54,51.59 17.78,53.34
  Bottom 1.016: 64.77,44.45 68.58,48.26
  Bottom 1.524: v43.5,44.45 64.77,44.45
  Bottom 1.778: 1S_LIPO.2 75.49,18.49 71.12,22.86 v71.12,32.23 71.12,50.8
  other vias: 58.42,82.97 55.88,82.87 40.64,82.97 38.1,82.87 67.31,53.02 68.9,50.16 71.12,58.74 18.41,67.31 18.41,63.19 18.41,59.06 18.41,54.93 66.36,71.12 66.36,73.66 65.72,76.83
  pour Top (no thermals): 15.49,88.14 15.49,86.87 15.88,86.49 17.65,86.49 18.03,86.11 24.89,86.11 25.15,86.36 25.15,89.92 24.89,90.17 23.11,90.17 22.86,89.92 22.86,86.87 22.61,86.61 18.29,86.61 17.4,87.5 17.4,88.14
  pour Bottom (no thermals): 33.02,83.82 31.75,83.82 30.48,82.55 30.48,80.01 31.75,78.74 33.02,77.47 64.77,77.47 66.04,78.74 67.31,80.01 67.31,82.55 66.04,83.82
  pour Top (no thermals): 48.39,72.64 50.29,72.64 50.93,73.28 50.93,76.71 51.44,77.22 55.5,77.22 55.75,76.96 55.75,75.44 55.5,75.18 52.58,75.18 51.31,73.91 51.31,72.39 50.93,72.01 48.39,72.01
  pour Bottom (no thermals): 50.8,78.74 53.34,76.2 53.34,66.04 55.88,63.5 63.5,63.5 67.31,67.31 67.31,76.2 66.04,77.47 66.04,78.74
  pour Bottom (no thermals): 71.12,48.26 73.66,50.8 73.66,60.96 67.31,67.31 63.5,63.5 63.5,50.8 66.04,48.26
  pour Bottom (no thermals): 55.88,63.5 63.5,55.88 63.5,63.5
  pour Bottom (no thermals): 46.35,42.55 46.35,38.73 43.18,35.56 43.18,45.72
  pour Bottom (no thermals): 20.32,53.34 15.24,53.34 15.24,71.12 17.78,73.66 20.32,71.12
  pour Bottom (no thermals): 15.24,71.12 15.24,78.74 17.78,81.28 30.48,81.28 35.56,81.28 35.56,78.74 27.94,71.12
  pour Bottom (no thermals): 63.5,50.8 63.5,45.09 70.8,37.78 73.66,40.64 73.66,51.44 73.03,50.8
  pour Bottom (no thermals): 35.56,83.82 45.72,93.98 50.8,93.98 60.96,83.82
  pour Bottom (no thermals): 20.32,66.04 25.4,71.12 20.32,71.12
  pour Bottom (no thermals): 15.24,53.34 17.78,50.8 20.32,50.8 20.32,53.34
MASTER_RX-2
  Top 0.508: J1-CP.2 23.5,18.47 25.4,16.56 27.39,16.56 45.17,34.34 68.63,34.34 J1-9P.7
MASTER_TX-2
  Top 0.508: J1-9P.9 74.3,37.47 73.66,36.83 70.51,33.68 45.45,33.68 27.67,15.9 22.86,15.9 20.95,17.8 J1-CP.3
N$1  (via drill 3 pad 4)
  other vias: 5.08,5.08
N$3  (via drill 3 pad 4)
  other vias: 5.08,96.52
N$4  (via drill 3 pad 4)
  other vias: 96.52,96.52
N$5  (via drill 3 pad 4)
  other vias: 96.52,5.08
RTS
  Top 0.508: J1-CP.1 26.04,19.68 27.81,17.91 44.9,35 66.75,35 J1-9P.5
SENSE_A
  Top 0.508: R3-5P.2 48.26,51.75 R4-5P.2 46.67,52.39 45.72,53.34 J3-CP.1
SENSE_B  (via drill 0.35)
  Top 0.508: R7-5P.2 53.34,51.75 R8-5P.2 51.75,52.39 v50.8,53.34 | v40.64,50.8 J3-CP.2
  Bottom 0.508: v50.8,53.34 43.18,53.34 v40.64,50.8
SENSE_C  (via drill 0.35)
  Top 0.508: R3-6P.2 58.42,51.75 R4-6P.2 v55.88,52.39 | v40.64,48.26 J3-CP.3
  Bottom 0.508: v55.88,52.39 44.77,52.39 v40.64,48.26
SENSE_D  (via drill 0.35)
  Top 0.508: R7-6P.2 63.5,51.75 R8-6P.2 61.91,52.39 v60.4,50.88 | v40.64,45.72 J3-CP.4
  Bottom 0.508: v60.4,50.88 60.33,50.8 45.72,50.8 v40.64,45.72
U1P-PROG
  Top 0.508: U1-P.5 21.57,89.04 R2-1P.2
U1P-STAT
  Top 0.508: U1-P.1 19.07,89.24 R1-1P.2
U2P-FB
  Top 0.381: U2-P.15 49.85,83.77 R1-2P.1
  Top 0.508: C3-2P.2 R1-2P.1 R2-2P.2
U9P-FB
  Top 0.508: C1-9P.2 61.98,71.12 | U9-P.4 57.72,71.44 59.19,69.96 60.83,69.96 61.98,71.12 | 61.98,71.12 C2-9P.1 R2-9P.2 R1-9P.1
U9P-LX1
  Top 0.254: 47.26,91.25 L1-2P.2
  pour Top (no thermals): 47.78,88.27 47.78,93.19 46.51,93.19 46.51,88.74 46.99,88.27
U9P-LX2
  Top 0.254: 49.26,91.25 L1-2P.1
  pour Top (no thermals): 48.74,88.27 48.74,93.19 50.01,93.19 50.01,88.74 49.53,88.27
U9P-SW
  pour Top (no thermals): 51.82,72.64 51.82,73.91 52.2,74.3 55.63,74.3 55.88,74.04 55.88,72.9 55.63,72.64
V_LDO_IN
  Top 0.381: U2-P.11 46.72,83.82 45.72,83.82
  Top 0.508: C1-2P.1 40.54,84.77 C2-2P.1 | 76.19,53.02 D1-11P.1 73.36,50.16 C1-11P.1 70.8,52.7 R1-11P.2 72.71,53.02 73.03,53.34 73.03,56.19 72.06,57.15 54.61,57.15 42.4,69.36 42.4,84.31 42.55,84.45
  pour Top (no thermals): 45.72,83.82 46.61,84.71 46.61,84.96 46.61,87.63 45.85,88.39 33.78,88.39 31.62,86.23 31.62,84.2 32,83.82
VBAT  (via drill 0.35)
  Top 0.508: C2-1P.1 U1-P.3 | J2-P.1 v48.26,21.59 | J2-P.3 v53.34,21.59 | J2-P.5 v58.42,21.59 | J2-P.7 v63.5,21.59 | 1S_LIPO.1 81.84,16.51 v68.58,16.51
  Bottom 0.508: v68.58,16.51 64.77,16.51 J2-P.7 | R5-11P.1 86.04,53.34 86.36,53.34 86.36,46.83 95.22,37.97 95.22,32.99 S1-P.P 88.9,26.67 88.9,23.54 84.57,19.21 84.54,19.21 1S_LIPO.1 92.15,18.49 96.2,22.54 96.2,38.1 87.31,46.99 87.31,80.33 71.12,96.52 19.05,96.52 16.51,93.98 C2-1P.1
  other vias: 83.5,55.88 16.51,85.41
  pour Top (no thermals): 15.49,85.85 15.75,86.11 17.27,86.11 17.65,85.72 20.07,85.72 20.07,85.09 19.56,84.58 16,84.58 15.49,85.09
  pour Bottom (no thermals): 48.26,22.86 63.5,22.86 66.04,20.32 66.04,17.78 63.5,15.24 48.26,15.24 45.72,17.78 45.72,20.32
  pour Bottom (no thermals): 83.82,55.88 86.36,55.88 86.36,53.34
VBAT_AFTER_SWITCH  (via drill 0.35)
  Top 0.508: D1-11P.2 R4-11P.1 78.74,56.2 | v78.74,50.8 78.74,56.2 | R5-11P.2 79.06,55.88 78.74,56.2
  Bottom 0.508: v78.74,50.8 78.74,49.53 S1-P.S
VUSB
  Top 0.508: JP-CP.4 63.5,86.36 55.88,93.98 38.1,93.98 28.89,84.78 C1-1P.1 24.97,85.62 25.05,85.62 26.67,87.24 26.67,90.17 25.4,91.44 D1-1P.A
  pour Top (no thermals): 20.57,85.72 20.57,85.09 21.59,84.07 27.43,84.07 28.07,84.71 28.19,84.84 28.19,85.22 27.81,85.6 27.69,85.72